# EAGLE design TOPCPCB_IXYS (EAGLE 9.6.2)
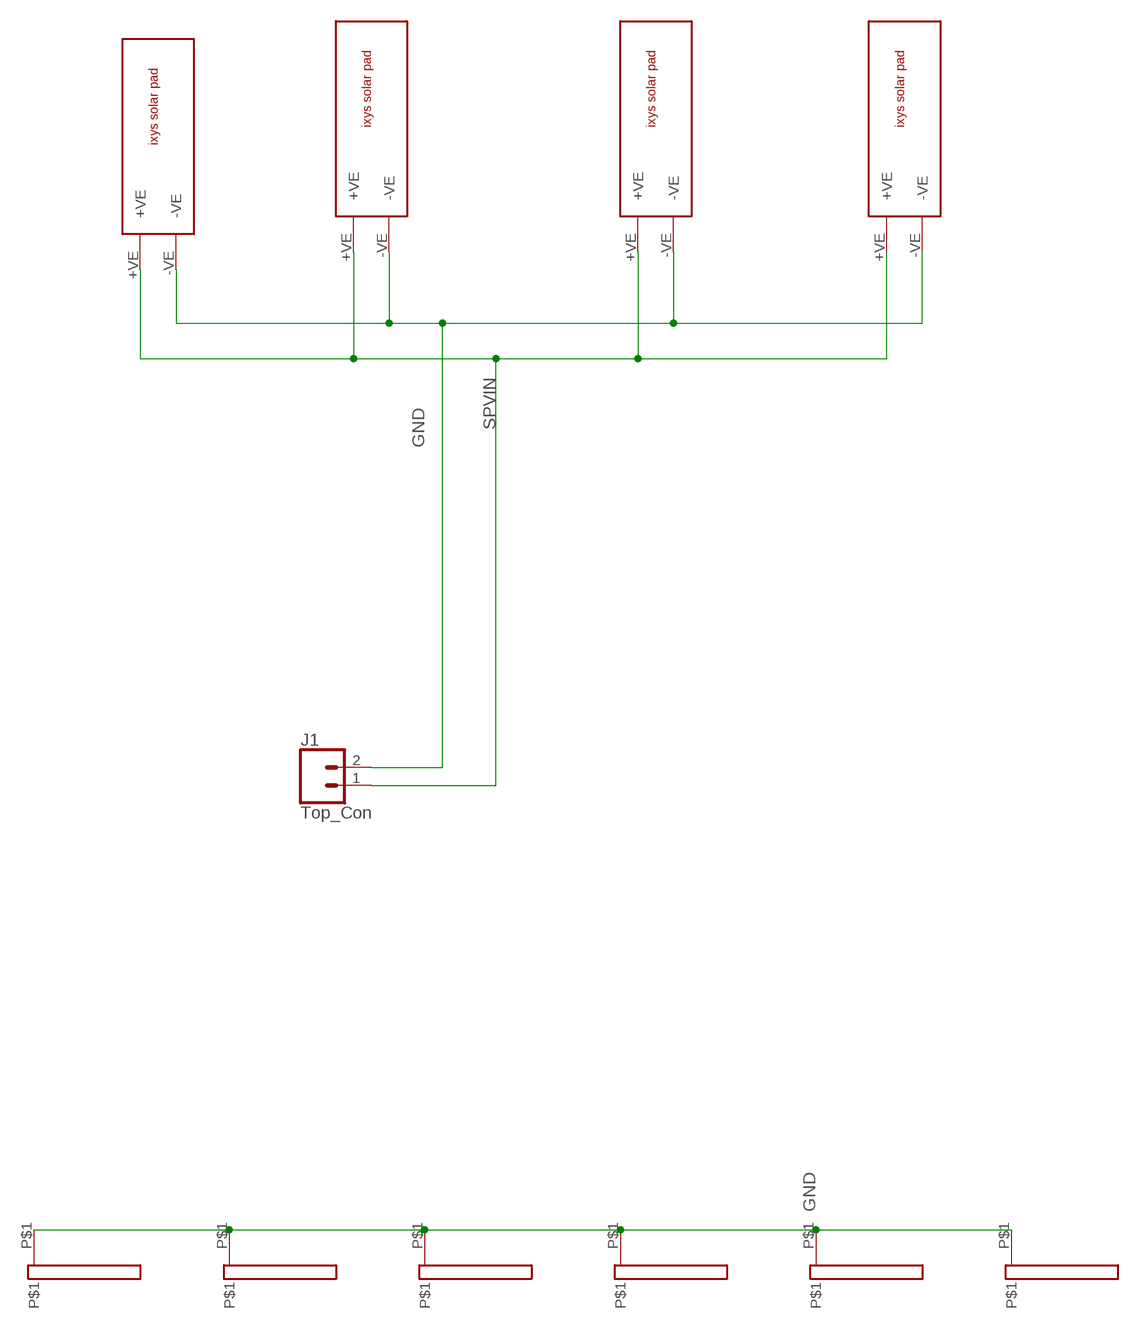
[diagram p0: schematic, sheet 1]

## Parts
J1  Top_Con  CONN_02  [1X02]
LEFTSOLD  16X2  [16X2]
U$1  16X2  [16X2]
U$2  IXYS  [IXYS]
U$3  IXYS  [IXYS]
U$4  16X2  [16X2]
U$5  16X2  [16X2]
U$6  IXYS  [IXYS]
U$7  16X2  [16X2]
U$8  IXYS  [IXYS]
U$9  16X2  [16X2]

## Nets
GND [vcc]: J1.2 LEFTSOLD.P$1 U$1.P$1 U$2.-VE U$3.-VE U$4.P$1 U$5.P$1 U$6.-VE U$7.P$1 U$8.-VE U$9.P$1
SPVIN: J1.1 U$2.+VE U$3.+VE U$6.+VE U$8.+VE

## Library data of the parts
J1 = SparkFun-Connectors:CONN_02: Multi connection point. Often used as Generic Header-pin footprint for 0.1 inch spaced/style header connections On any of the 0.1 inch spaced packages, you can populate with these: Break Away Headers - Straight <https://www.sparkfun.com/products/116> (PRT-00116) Break Away Male Headers - Right Angle <https://www.sparkfun.com/products/553> (PRT-00553) Female Headers <https://www.sparkfun.com/products/115> (PRT-00115) Break Away Headers - Machine Pin <https://www.sparkfun.com/products/117> (PRT-00117) Break Away Female Headers - Swiss Machine Pin <https://www.sparkfun.com/products/743> (PRT-00743) For SCREWTERMINALS and SPRING TERMINALS visit here: Screw Terimnals on SparkFun.com <https://www.sparkfun.com/search/results?term=Screw+Terminals> (5mm/3.5mm/2.54mm spacing) This device is also useful as a general connection point to wire up your design to another part of your project. Our various solder wires solder well into these plated through hole pads. Hook-Up Wire - Assortment (Stranded, 22 AWG) <https://www.sparkfun.com/products/11375> (PRT-11375) Hook-Up Wire - Assortment (Solid Core, 22 AWG) <https://www.sparkfun.com/products/11367> (PRT-11367) View the entire wire category on our website here <https://www.sparkfun.com/categories/141> Special notes: Molex polarized connector foot print use with: PRT-08233 with associated crimp pins and housings. 2.54_SCREWTERM for use with PRT-10571. 3.5mm Screw Terminal footprints for PRT-08084 5mm Screw Terminal footprints for use with PRT-08432
LEFTSOLD U$1 U$4 U$5 U$7 U$9 = 16x2PAD:16X2: Pad for 90 degree solder
U$2 U$3 U$6 U$8 = ixys:IXYS

## Net classes
1 vcc: width 0.254 mm

## Board
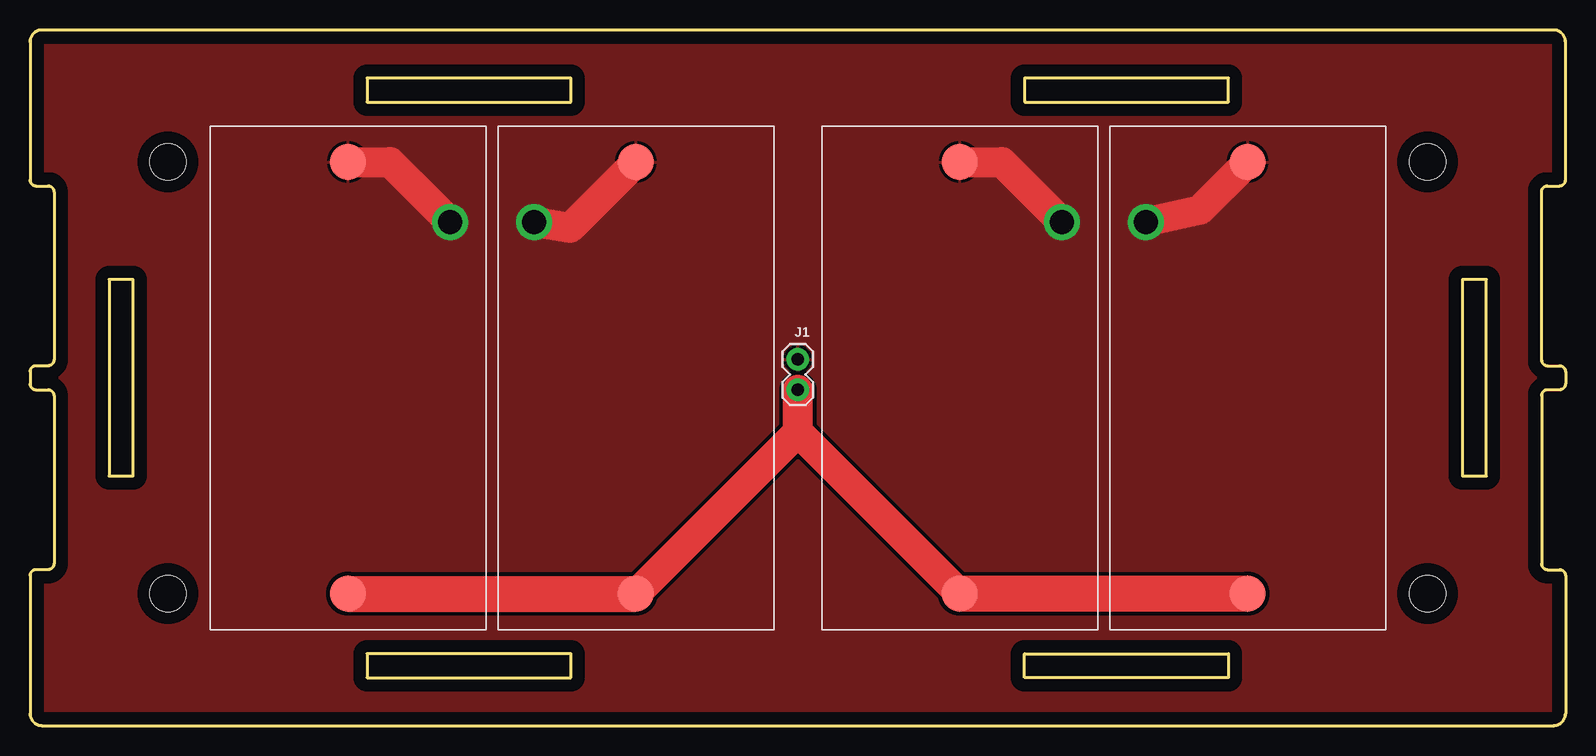
[diagram p1: board, top side]
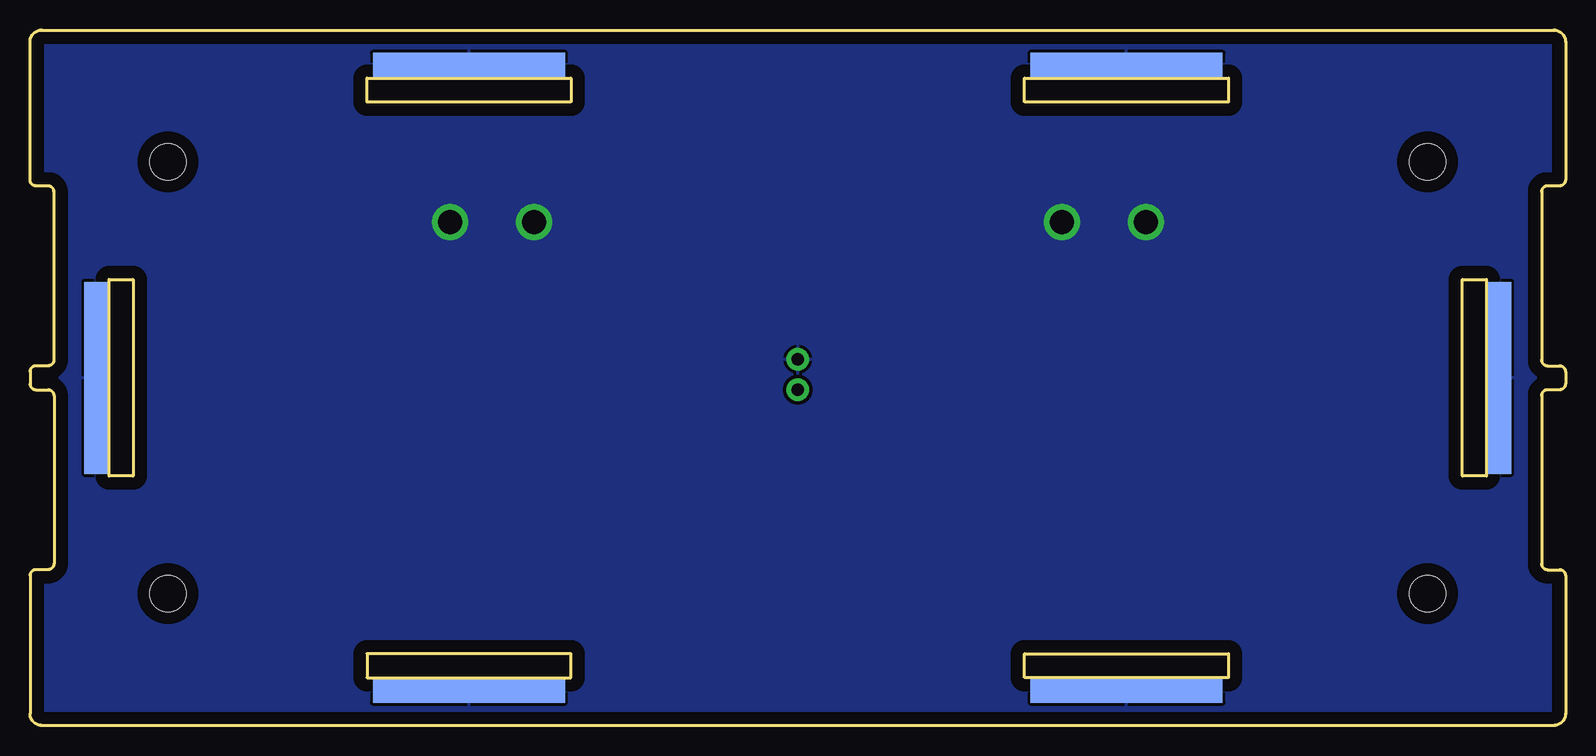
[diagram p2: board, bottom side, seen from below]

Size 128 x 58 mm. Coordinates in mm from the lower left corner, seen from the top.
Outline: 0,1 arc90 1,0 127,0 arc90 128,1 128,12.5 arc90 127.5,13 126.5,13 arc-90 126,13.5 126,27.5 arc-90 126.5,28 127.5,28 arc90 128,28.5 128,29.5 arc90 127.5,30 126.5,30 arc-90 126,30.5 126,44.5 arc-90 126.5,45 127.5,45 arc90 128,45.5 128,47.5 128,57 arc90 127,58 1,58 arc90 0,57 0,45.5 arc90 0.5,45 1.5,45 arc-90 2,44.5 2,30.5 arc-90 1.5,30 0.5,30 arc90 0,29.5 0,28.5 arc90 0.5,28 1.5,28 arc-90 2,27.5 2,13.5 arc-90 1.5,13 0.5,13 arc90 0,12.5 0,1
Outline: 45.1,54 28.1,54 28.1,52 45.1,52 45.1,54
Outline: 99.9,4 82.9,4 82.9,6 99.9,6 99.9,4
Outline: 99.9,54 82.9,54 82.9,52 99.9,52 99.9,54
Outline: 28.1,4 45.1,4 45.1,6 28.1,6 28.1,4
Outline: 119.4,37.2 119.4,20.8 121.4,20.8 121.4,37.2 119.4,37.2
Outline: 6.6,37.2 6.6,20.8 8.6,20.8 8.6,37.2 6.6,37.2
Copper layers (1*16): Top 0.035mm / dielectric 1.5mm / Bottom 0.035mm
Design rules "default *": minimum track width 6mil, minimum drill 0.35mm, track to track 12mil, track to pad 6mil, pad to pad 6mil, via to via 6mil, smd to smd 6mil, copper to edge 40mil, drill to drill 6mil, minimum pad ring 10mil, minimum via ring 8mil, stop-mask expansion 4mil, vias tented up to drill 0mil, thermal gap 10mil
Holes 3 mm at 11.5,47 11.5,11 116.5,11 116.5,47

### Footprints (pad centres in the part's own frame; a part is rotated, then mirrored left to right if it is on the bottom)
1X02 = drill 1.016 pad 1.88: 1 0,0; 2 2.54,0
16X2 = smd 16 x 2: P$1 0,0
IXYS = smd 3 x 3: +VE 3,11.5; -VE 39,11.5

### Placement (x,y rotation side)
J1  64,28 90 top
LEFTSOLD  5.53,28.99 270 bottom
U$1  122.47,28.99 270 bottom
U$2  38,8 90 top
U$3  62,8 90 top
U$4  36.6,2.9 0 bottom
U$5  36.6,55.1 0 bottom
U$6  89,8 90 top
U$7  91.4,2.9 0 bottom
U$8  113,8 90 top
U$9  91.4,55.1 0 bottom

### Tracks (layer width: path | path; a pad name or v marks a point on that pad's centre or on a via)
GND  (via drill 2)
  Top 2.5: U$2.-VE 30,47 v35,42 | U$3.-VE 45,41.5 v42,42 | U$6.-VE 81,47 v86,42 | U$8.-VE 97.5,43 v93,42
  pour Top: -8.5,58.5 -2,65 129.5,65 135,59.5 135,-2 130.5,-6.5 -1,-6.5 -8.5,1
  pour Bottom: -8.5,58.5 -2,65 129.5,65 135,59.5 135,-2 130.5,-6.5 -1,-6.5 -8.5,1
SPVIN
  Top 2.5: U$3.+VE 64,24.5 | U$6.+VE 64,24.5 | 64,24.5 J1.1
  Top 3: U$2.+VE U$3.+VE | U$8.+VE U$6.+VE